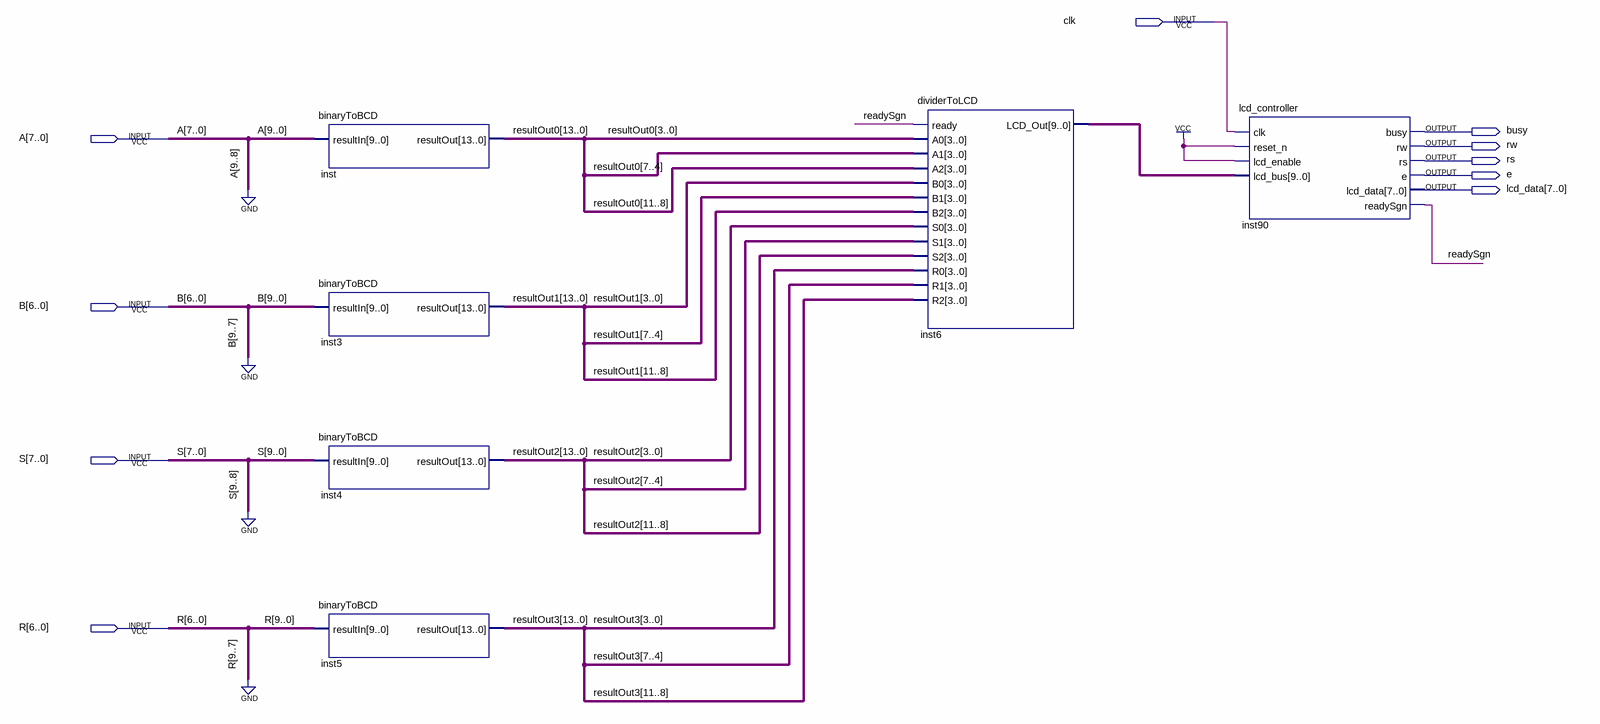
[diagram p0: schematic sheet]
// Quartus schematic Divider_Out.bdf as structural Verilog: 6 symbols, 10 pins
module Divider_Out (
  input  clk,
  input  [7:0] A,
  input  [6:0] B,
  input  [7:0] S,
  input  [6:0] R,
  output busy,
  output rw,
  output rs,
  output e,
  output [7:0] lcd_data
);

  wire readySgn;
  wire [9:0] inst6_lcd_out;
  wire [13:0] resultOut0, resultOut1, resultOut2, resultOut3;

  binaryToBCD inst (.resultIn({2'b00, A}), .resultOut(resultOut0));
  binaryToBCD inst3 (.resultIn({3'b000, B}), .resultOut(resultOut1));
  binaryToBCD inst4 (.resultIn({2'b00, S}), .resultOut(resultOut2));
  binaryToBCD inst5 (.resultIn({3'b000, R}), .resultOut(resultOut3));
  dividerToLCD inst6 (
    .ready(readySgn), .A0(resultOut0[3:0]), .A1(resultOut0[7:4]), .A2(resultOut0[11:8]),
    .B0(resultOut1[3:0]), .B1(resultOut1[7:4]), .B2(resultOut1[11:8]), .S0(resultOut2[3:0]),
    .S1(resultOut2[7:4]), .S2(resultOut2[11:8]), .R0(resultOut3[3:0]), .R1(resultOut3[7:4]),
    .R2(resultOut3[11:8]), .LCD_Out(inst6_lcd_out));
  lcd_controller inst90 (
    .clk(clk), .reset_n(1'b1), .lcd_enable(1'b1), .lcd_bus(inst6_lcd_out), .busy(busy), .rw(rw), .rs(rs),
    .e(e), .lcd_data(lcd_data), .readySgn(readySgn));
endmodule
